# EAGLE design ATXmega FPC adapter (EAGLE 6.4)
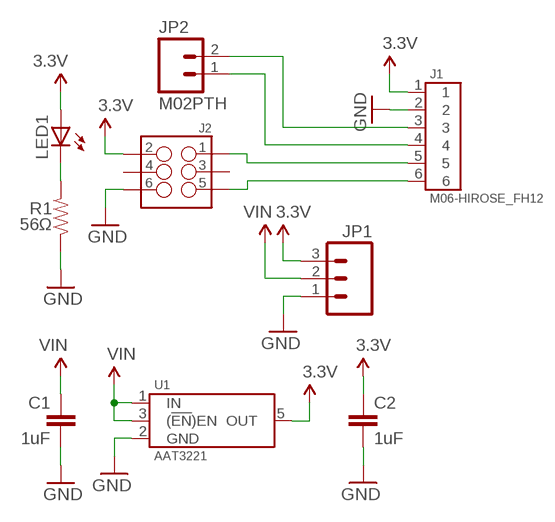
[diagram p0: schematic, sheet 1]

## Parts
C1  1uF  CAP0603-CAP  [0603-CAP]
C2  1uF  CAP0603-CAP  [0603-CAP]
J1  M06-HIROSE_FH12  [FH12-6S-1SH(55)]
J2  M03X2SHROUD  [2X3-SHROUDED]
JP1  M03PTH  [1X03]
JP2  M02PTH  [1X02]
LED1  LED0603  [LED-0603]
R1  56Ω  RESISTOR0603-RES  [0603-RES]
U1  AAT3221  [SOT23-5]

## Nets
3.3V: C2.1 J1.1 J2.2 JP1.3 LED1.A U1.5(OUT)
GND: C1.2 C2.2 J1.2 J2.6 JP1.1 R1.1 U1.2(GND)
N$1: J1.5 J2.1
N$2: J1.6 J2.5
N$3: LED1.C R1.2
N$4: J1.3 JP2.2
N$5: J1.4 JP2.1
VIN: C1.1 JP1.2 U1.1(IN) U1.3((!EN!)EN)
Unconnected: J2.3 J2.4

## Library data of the parts
C1 C2 = SparkFun-Passives:CAP: Capacitor Standard 0603 ceramic capacitor, and 0.1" leaded capacitor.
J1 = Hirose:M06
J2 = SparkFun-Connectors:M03X2: 2x3 .1" header. Shrouded, with keying- CONN-10681 SMT- CONN-11415 Pogo pins- HW-11044; PROD_ID: CONN-10681
JP1 = SparkFun-Connectors:M03: Header 3 Standard 3-pin 0.1" header. Use with straight break away headers (SKU : PRT-00116), right angle break away headers (PRT-00553), swiss pins (PRT-00743), machine pins (PRT-00117), and female headers (PRT-00115). Molex polarized connector foot print use with SKU : PRT-08232 with associated crimp pins and housings.
JP2 = SparkFun-Connectors:M02: Standard 2-pin 0.1" header. Use with - straight break away headers ( PRT-00116) - right angle break away headers (PRT-00553) - swiss pins (PRT-00743) - machine pins (PRT-00117) - female headers (PRT-00115) Molex polarized connector foot print use with: PRT-08233 with associated crimp pins and housings. 2.54_SCREWTERM for use with PRT-10571. 3.5mm Screw Terminal footprints for PRT-08084 5mm Screw Terminal footprints for use with PRT-08433
LED1 = SparkFun-LED:LED: LEDs Standard schematic elements and footprints for 5mm, 3mm, 1206, and 0603 sized LEDs. 5mm - Spark Fun Electronics SKU : COM-00529 (and others)
R1 = SparkFun-Passives:RESISTOR: Resistor Basic schematic elements and footprints for 0603, 1206, and PTH resistors.
U1 = Skyworks:AAT3221: 150mA 3.3v LDO Regulator

## Board
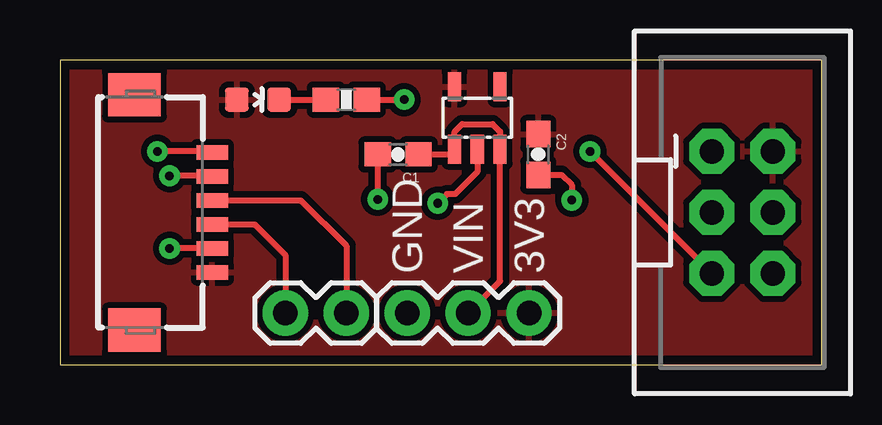
[diagram p1: board, top side]
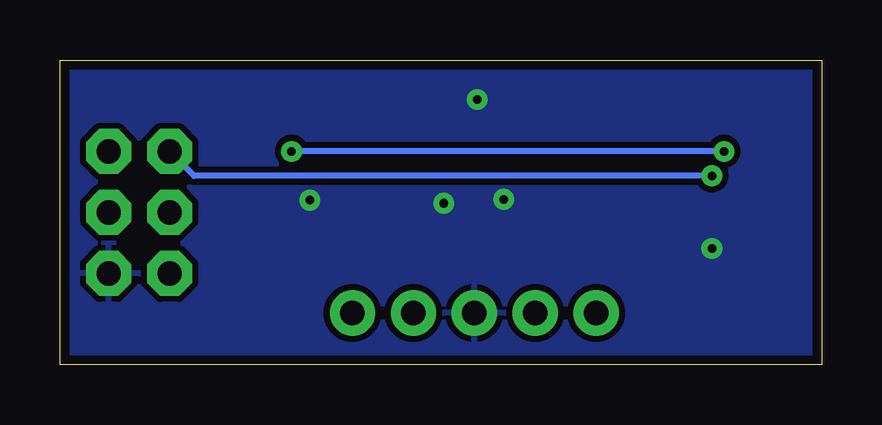
[diagram p2: board, bottom side, seen from below]

Size 31.75 x 12.7 mm. Coordinates in mm from the lower left corner, seen from the top.
Outline: 0,0 31.75,0 31.75,12.7 0,12.7 0,0
Copper layers (1*16): Top 0.0356mm / dielectric 1.5011mm / Bottom 0.0356mm
Design rules "LaenPCBOrder": minimum track width 6mil, minimum drill 13mil, track to track 6mil, track to pad 6mil, pad to pad 6mil, via to via 6mil, smd to smd 6mil, copper to edge 15mil, drill to drill 6mil, minimum pad ring 12mil, minimum via ring 10mil, stop-mask expansion 4mil, vias tented up to drill 15mil, thermal gap 10mil

### Footprints (pad centres in the part's own frame; a part is rotated, then mirrored left to right if it is on the bottom)
0603-CAP = smd 1.1 x 1: 1 -0.85,0; 2 0.85,0
FH12-6S-1SH(55) = smd 0.6 x 1.3: 1 -2.5,0; 2 -1.5,0; 3 -0.5,0; 4 0.5,0; 5 1.5,0; 6 2.5,0 | smd 1.8 x 2.2: P$7 -4.9,3.25; P$8 4.9,3.25
2X3-SHROUDED = drill 1.016 pad 1.88 octagon: 1 -1.27,2.54; 2 1.27,2.54; 3 -1.27,0; 4 1.27,0; 5 -1.27,-2.54; 6 1.27,-2.54
1X03 = drill 1.016 pad 1.88: 1 0,0; 2 2.54,0; 3 5.08,0
1X02 = drill 1.016 pad 1.88: 1 0,0; 2 2.54,0
LED-0603 = smd 1 x 1: A 0,-0.877; C 0,0.877
0603-RES = smd 1.1 x 1: 1 -0.85,0; 2 0.85,0
SOT23-5 = smd 1.2 x 0.55: 1 1.3,-0.95; 2 1.3,0; 3 1.3,0.95; 4 -1.3,0.95; 5 -1.3,-0.95

### Placement (x,y rotation side)
C1  14.1,8.76 180 top
C2  19.94,8.76 270 top
J1  6.35,6.35 90 top
J2  28.45,6.35 0 top
JP1  14.48,2.16 0 top
JP2  11.94,2.16 180 top
LED1  8.26,11.05 270 top
R1  11.94,11.05 180 top
U1  17.4,10.29 270 top

### Tracks (layer width: path | path; a pad name or v marks a point on that pad's centre or on a via)
3.3V
  pour Top (isolate 0.254): -1.27,13.97 34.29,13.97 34.29,-1.27 -1.27,-1.27
GND  (via drill 0.36)
  Top 0.254: R1.1 v14.35,11.05 | 19.98,7.87 C2.2 20.92,7.91 21.34,7.49 v21.34,6.86 | J1.2 v4.57,4.85 | C1.2 v13.25,6.9 | U1.2 17.4,8.04 16.47,7.11 16.13,7.11 v15.75,6.73
  pour Bottom (isolate 0.254): -2.54,15.24 35.56,15.24 35.56,-2.54 -2.54,-2.54
N$1  (via drill 0.36)
  Top 0.254: J1.5 6.33,7.87 v4.57,7.87
  Bottom 0.254: J2.1 26.16,7.87 v4.57,7.87
N$2  (via drill 0.36)
  Top 0.254: v22.1,8.89 J2.5 | J1.6 6.31,8.89 v4.06,8.89
  Bottom 0.254: v4.06,8.89 v22.1,8.89
N$3
  Top 0.254: LED1.C R1.2
N$4
  Top 0.254: J1.3 8.12,5.85 9.4,4.57 JP2.2
N$5
  Top 0.254: J1.4 10.04,6.85 11.94,4.95 JP2.1
VIN
  Top 0.254: C1.1 16.23,8.76 U1.1 16.45,9.72 16.76,10.03 18.03,10.03 18.35,9.72 U1.3 18.35,3.49 JP1.2

### Text on the board
tPlace: GND | VIN | 3V3